# EAGLE design kegboard-mini (EAGLE 6.5.0)
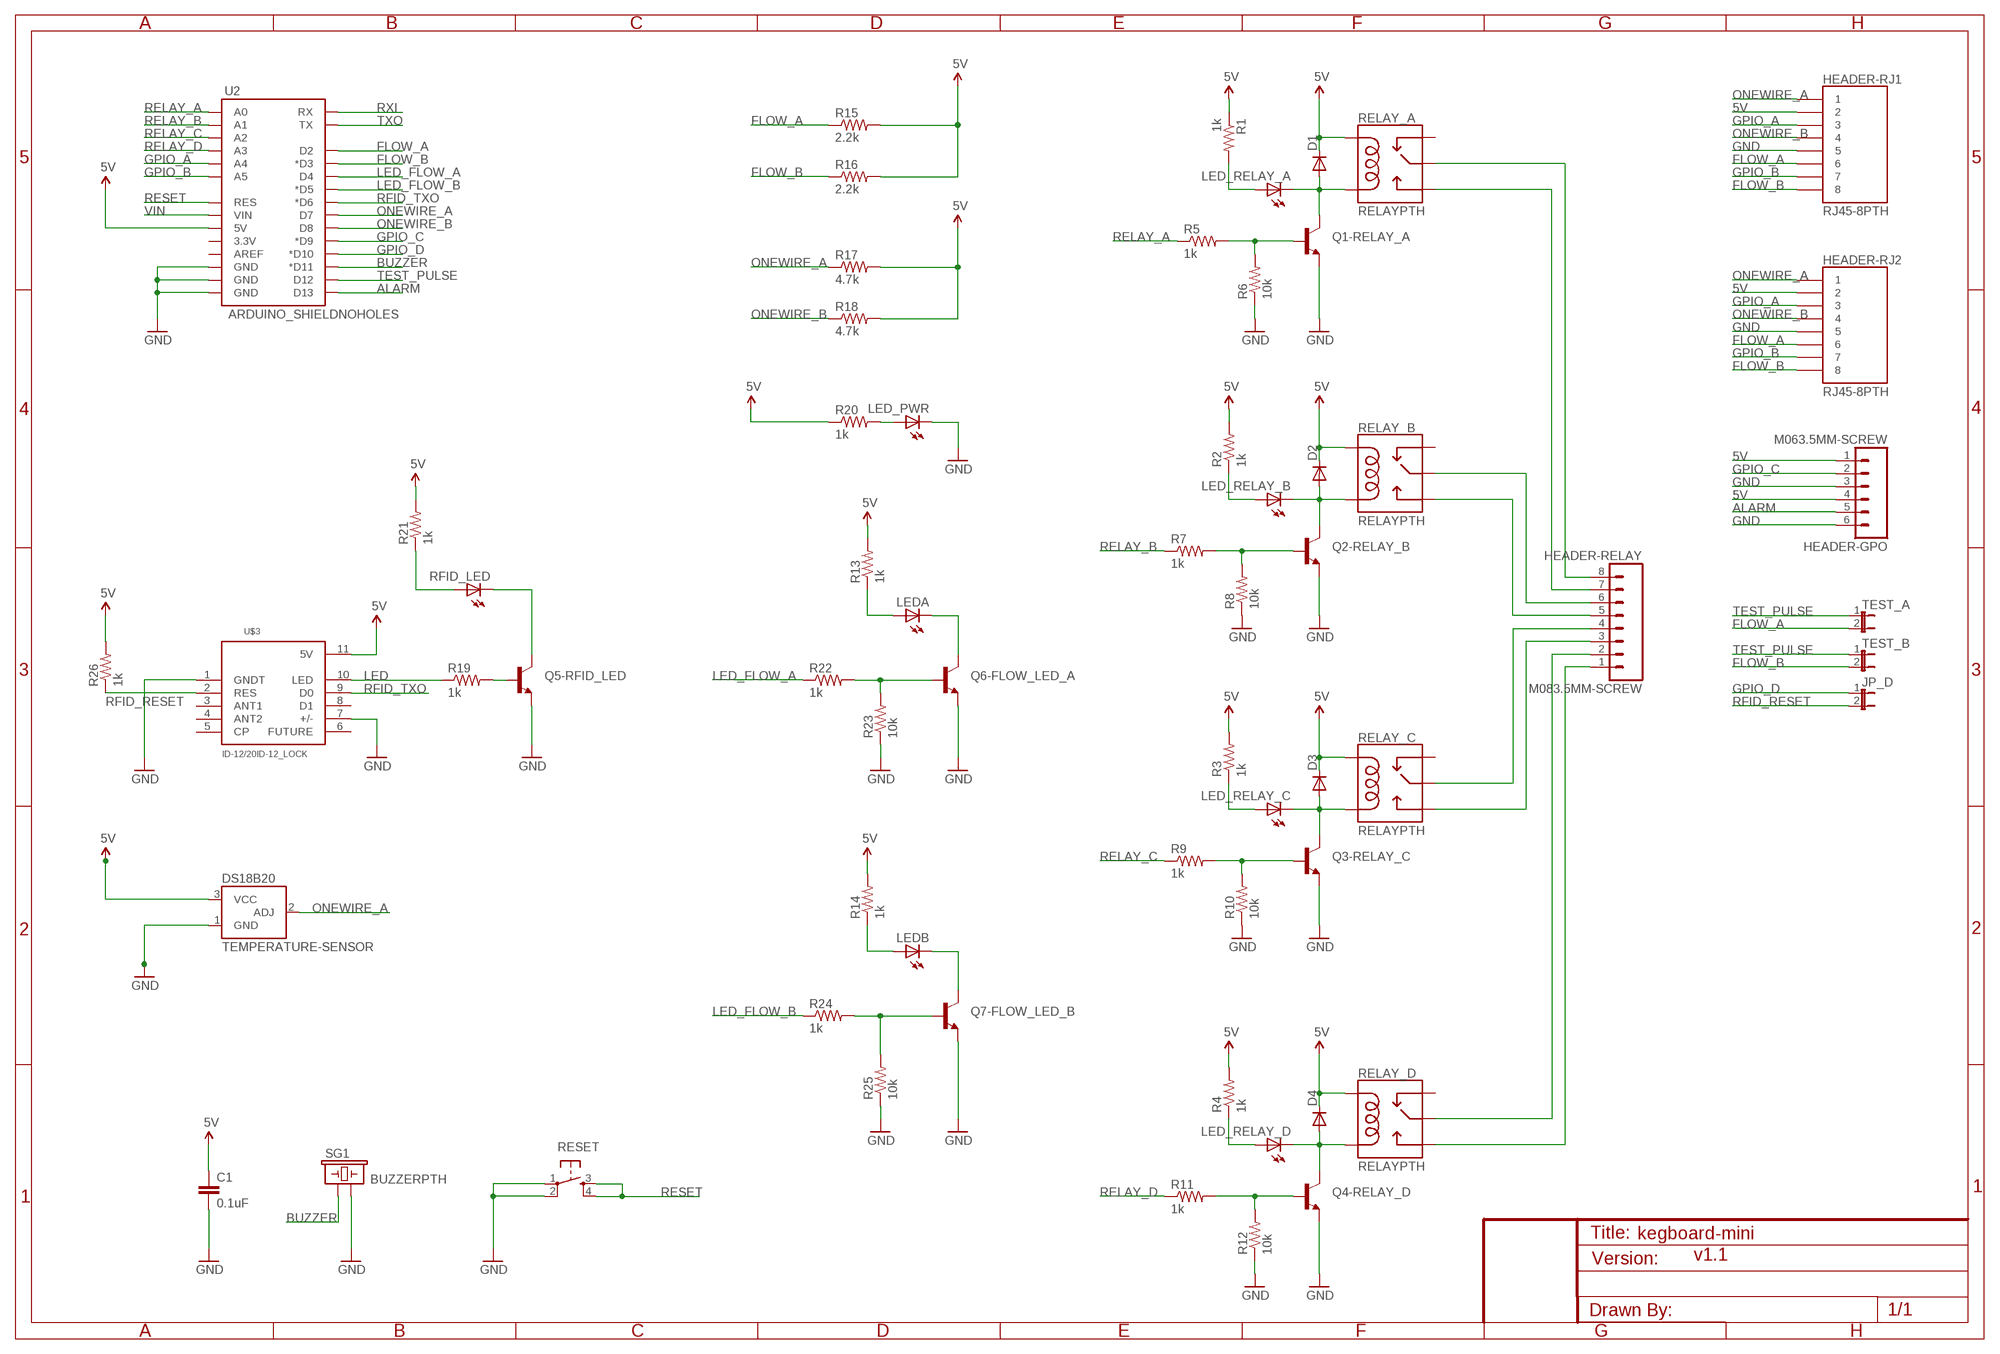
[diagram p0: schematic, sheet 1]

## Parts
C1  0.1uF  CAPPTH  [CAP-PTH-SMALL]
D1  DIODE1N4148  [DIODE-1N4148]
D2  DIODE1N4148  [DIODE-1N4148]
D3  DIODE1N4148  [DIODE-1N4148]
D4  DIODE1N4148  [DIODE-1N4148]
DS18B20  TEMPERATURE-SENSOR  [TO-92]
HEADER-GPO  M063.5MM-SCREW  M063.5MM-6  [SCREWTERMINAL-3.5MM-6]
HEADER-RELAY  M083.5MM-SCREW  M083.5MM-8  [SCREWTERMINAL-3.5MM-8]
HEADER-RJ1  RJ45-8PTH  [RJ45-8]
HEADER-RJ2  RJ45-8PTH  [RJ45-8]
JP_D  JUMPER-2PTH  [1X02]
LED_PWR  LED3MM  [LED3MM]
LED_RELAY_A  LED3MM  [LED3MM]
LED_RELAY_B  LED3MM  [LED3MM]
LED_RELAY_C  LED3MM  [LED3MM]
LED_RELAY_D  LED3MM  [LED3MM]
LEDA  LED3MM  [LED3MM]
LEDB  LED3MM  [LED3MM]
Q1-RELAY_A  TRANSISTOR_NPNTO92  [TO-92]
Q2-RELAY_B  TRANSISTOR_NPNTO92  [TO-92]
Q3-RELAY_C  TRANSISTOR_NPNTO92  [TO-92]
Q4-RELAY_D  TRANSISTOR_NPNTO92  [TO-92]
Q5-RFID_LED  TRANSISTOR_NPNTO92  [TO-92]
Q6-FLOW_LED_A  TRANSISTOR_NPNTO92  [TO-92]
Q7-FLOW_LED_B  TRANSISTOR_NPNTO92  [TO-92]
R1  1k  RESISTORPTH1  [AXIAL-0.3]
R2  1k  RESISTORPTH1  [AXIAL-0.3]
R3  1k  RESISTORPTH1  [AXIAL-0.3]
R4  1k  RESISTORPTH1  [AXIAL-0.3]
R5  1k  RESISTORPTH1  [AXIAL-0.3]
R6  10k  RESISTORPTH1  [AXIAL-0.3]
R7  1k  RESISTORPTH1  [AXIAL-0.3]
R8  10k  RESISTORPTH1  [AXIAL-0.3]
R9  1k  RESISTORPTH1  [AXIAL-0.3]
R10  10k  RESISTORPTH1  [AXIAL-0.3]
R11  1k  RESISTORPTH1  [AXIAL-0.3]
R12  10k  RESISTORPTH1  [AXIAL-0.3]
R13  1k  RESISTORPTH1  [AXIAL-0.3]
R14  1k  RESISTORPTH1  [AXIAL-0.3]
R15  2.2k  RESISTORPTH1  [AXIAL-0.3]
R16  2.2k  RESISTORPTH1  [AXIAL-0.3]
R17  4.7k  RESISTORPTH1  [AXIAL-0.3]
R18  4.7k  RESISTORPTH1  [AXIAL-0.3]
R19  1k  RESISTORPTH1  [AXIAL-0.3]
R20  1k  RESISTORPTH1  [AXIAL-0.3]
R21  1k  RESISTORPTH1  [AXIAL-0.3]
R22  1k  RESISTORPTH1  [AXIAL-0.3]
R23  10k  RESISTORPTH1  [AXIAL-0.3]
R24  1k  RESISTORPTH1  [AXIAL-0.3]
R25  10k  RESISTORPTH1  [AXIAL-0.3]
R26  1k  RESISTORPTH1  [AXIAL-0.3]
RELAY_A  RELAYPTH  [RELAY-G5Q]
RELAY_B  RELAYPTH  [RELAY-G5Q]
RELAY_C  RELAYPTH  [RELAY-G5Q]
RELAY_D  RELAYPTH  [RELAY-G5Q]
RESET  TAC_SWITCHPTH  [TACTILE-PTH]
RFID_LED  LED3MM  [LED3MM]
SG1  BUZZERPTH  [BUZZER-12MM]
TEST_A  JUMPER-2PTH  [1X02]
TEST_B  JUMPER-2PTH  [1X02]
U2  ARDUINO_SHIELDNOHOLES  [DUEMILANOVE_SHIELD_NOHOLES]
U$3  ID-12/20ID-12_LOCK  [ID-12_LOCK]

## Nets
5V: C1.1 D1.C D2.C D3.C D4.C DS18B20.3(VCC) HEADER-GPO.1 HEADER-GPO.4 HEADER-RJ1.2 HEADER-RJ2.2 R1.P$1 R2.P$2 R3.P$2 R4.P$2 R13.P$2 R14.P$2 R15.P$2 R16.P$2 R17.P$2 R18.P$2 R20.P$1 R21.P$2 R26.P$2 RELAY_A.5(COIL1) RELAY_B.5(COIL1) RELAY_C.5(COIL1) RELAY_D.5(COIL1) U2.5V U$3.11(5V)
ALARM: HEADER-GPO.5 U2.D13
BUZZER: SG1.+ U2.D11(*D11)
FLOW_A: HEADER-RJ1.6 HEADER-RJ2.6 R15.P$1 TEST_A.2 U2.D2
FLOW_B: HEADER-RJ1.8 HEADER-RJ2.8 R16.P$1 TEST_B.2 U2.D3(*D3)
GND: C1.2 DS18B20.1(GND) HEADER-GPO.3 HEADER-GPO.6 HEADER-RJ1.5 HEADER-RJ2.5 LED_PWR.K(C) Q1-RELAY_A.1(E) Q2-RELAY_B.1(E) Q3-RELAY_C.1(E) Q4-RELAY_D.1(E) Q5-RFID_LED.1(E) Q6-FLOW_LED_A.1(E) Q7-FLOW_LED_B.1(E) R6.P$1 R8.P$1 R10.P$1 R12.P$1 R23.P$1 R25.P$1 RESET.1 RESET.2 SG1.- U2.GND@0(GND) U2.GND@1(GND) U2.GND@2(GND) U$3.1(GNDT) U$3.7(+/-)
GPIO_A: HEADER-RJ1.3 HEADER-RJ2.3 U2.A4
GPIO_B: HEADER-RJ1.7 HEADER-RJ2.7 U2.A5
GPIO_C: HEADER-GPO.2 U2.D9(*D9)
GPIO_D: JP_D.1 U2.D10(*D10)
LED: R19.P$1 U$3.10(LED)
LED_FLOW_A: R22.P$1 U2.D4
LED_FLOW_B: R24.P$1 U2.D5(*D5)
N$1: LED_RELAY_A.A R1.P$2
N$2: Q2-RELAY_B.2(B) R7.P$2 R8.P$2
N$3: Q1-RELAY_A.2(B) R5.P$2 R6.P$2
N$4: Q3-RELAY_C.2(B) R9.P$2 R10.P$2
N$5: LED_RELAY_C.A R3.P$1
N$6: Q4-RELAY_D.2(B) R11.P$2 R12.P$2
N$7: LED_RELAY_B.A R2.P$1
N$8: LEDB.K(C) Q7-FLOW_LED_B.3(C)
N$9: LEDA.K(C) Q6-FLOW_LED_A.3(C)
N$10: D1.A LED_RELAY_A.K(C) Q1-RELAY_A.3(C) RELAY_A.1(COIL2)
N$11: LED_RELAY_D.A R4.P$1
N$12: D2.A LED_RELAY_B.K(C) Q2-RELAY_B.3(C) RELAY_B.1(COIL2)
N$13: LED_PWR.A R20.P$2
N$14: D3.A LED_RELAY_C.K(C) Q3-RELAY_C.3(C) RELAY_C.1(COIL2)
N$15: HEADER-RELAY.8 RELAY_A.2(MAIN)
N$16: D4.A LED_RELAY_D.K(C) Q4-RELAY_D.3(C) RELAY_D.1(COIL2)
N$17: Q5-RFID_LED.2(B) R19.P$2
N$18: R21.P$1 RFID_LED.A
N$19: Q5-RFID_LED.3(C) RFID_LED.K(C)
N$20: HEADER-RELAY.7 RELAY_A.3(NO)
N$21: HEADER-RELAY.6 RELAY_B.2(MAIN)
N$22: HEADER-RELAY.5 RELAY_B.3(NO)
N$23: HEADER-RELAY.4 RELAY_C.2(MAIN)
N$24: LEDA.A R13.P$1
N$25: HEADER-RELAY.3 RELAY_C.3(NO)
N$26: HEADER-RELAY.2 RELAY_D.2(MAIN)
N$27: HEADER-RELAY.1 RELAY_D.3(NO)
N$28: LEDB.A R14.P$1
N$30: Q6-FLOW_LED_A.2(B) R22.P$2 R23.P$2
N$31: Q7-FLOW_LED_B.2(B) R24.P$2 R25.P$2
ONEWIRE_A: DS18B20.2(ADJ) HEADER-RJ1.1 HEADER-RJ2.1 R17.P$1 U2.D7
ONEWIRE_B: HEADER-RJ1.4 HEADER-RJ2.4 R18.P$1 U2.D8
RELAY_A: R5.P$1 U2.A0
RELAY_B: R7.P$1 U2.A1
RELAY_C: R9.P$1 U2.A2
RELAY_D: R11.P$1 U2.A3
RESET: RESET.3 RESET.4 U2.RES
RFID_RESET: JP_D.2 R26.P$1 U$3.2(RES)
RFID_TXO: U2.D6(*D6) U$3.9(D0)
RXI: U2.RX
TEST_PULSE: TEST_A.1 TEST_B.1 U2.D12
TXO: U2.TX
VIN: U2.VIN
Unconnected: RELAY_A.4(NC) RELAY_B.4(NC) RELAY_C.4(NC) RELAY_D.4(NC) U2.3.3V U2.AREF U$3.3(ANT1) U$3.4(ANT2) U$3.5(CP) U$3.6(FUTURE) U$3.8(D1)

## Notes on the sheet
- v1.1

## Library data of the parts
C1 = SparkFun:CAP: Capacitor Standard 0603 ceramic capacitor, and 0.1" leaded capacitor.
D1-D4 = SparkFun:DIODE: Diode These are standard reverse protection diodes and small signal diodes. SMA package can handle up to about 1A. SOD-323 can handle about 200mA. What the SOD-323 package when ordering, there are some mfgs out there that are 5-pin packages.
DS18B20 = geoffculp:TEMPERATURE-SENSOR
HEADER-GPO = SparkFun:M06: Header 6 Standard 6-pin 0.1" header. Use with straight break away headers (SKU : PRT-00116), right angle break away headers (PRT-00553), swiss pins (PRT-00743), machine pins (PRT-00117), and female headers (PRT-00115). Molex polarized connector foot print use with SKU : PRT-08094 with associated crimp pins and housings. NOTES ON THE VARIANTS LOCK and LOCK_LONGPADS... This footprint was designed to help hold the alignment of a through-hole component (i.e. 6-pin header) while soldering it into place. You may notice that each hole has been shifted either up or down by 0.005 of an inch from it's more standard position (which is a perfectly straight line). This slight alteration caused the pins (the squares in the middle) to touch the edges of the holes. Because they are alternating, it causes a "brace" to hold the component in place. 0.005 has proven to be the perfect amount of "off-center" position when using our standard breakaway headers. Although looks a little odd when you look at the bare footprint, once you have a header in there, the alteration is very hard to notice. Also, if you push a header all the way into place, it is covered up entirely on the bottom side. This idea of altering the position of holes to aid alignment will be further integrated into the Sparkfun Library for other footprints. It can help hold any component with 3 or more connection pins.
HEADER-RELAY = SparkFun:M08: Header 8 Standard 8-pin 0.1" header. Use with straight break away headers (SKU : PRT-00116), right angle break away headers (PRT-00553), swiss pins (PRT-00743), machine pins (PRT-00117), and female headers (PRT-00115).
HEADER-RJ1 HEADER-RJ2 = SparkFun:RJ45-8: RJ45 Jack Simple RJ45, 8-pin connection - connector for common Cat5, Cat5e, and Cat6 Ethernet cables. Footprint not yet proven in production. Connector sku is PRT-00643; Breakout PCB sku is BOB-00716.
JP_D TEST_A TEST_B = SparkFun-20100412:JUMPER-2: Jumper Basic 0.1" spaced jumper. Use with breakaway headers.
LED_PWR LED_RELAY_A LED_RELAY_B LED_RELAY_C LED_RELAY_D LEDA LEDB RFID_LED = SparkFun:LED: LEDs Standard schematic elements and footprints for 5mm, 3mm, 1206, and 0603 sized LEDs. 5mm - Spark Fun Electronics SKU : COM-00529 (and others)
Q1-RELAY_A Q2-RELAY_B Q3-RELAY_C Q4-RELAY_D Q5-RFID_LED Q6-FLOW_LED_A Q7-FLOW_LED_B = SparkFun:TRANSISTOR_NPN: Transistor NPN BJT configuration in SOT23 package. MMBT2222 is the common NPN we use. Double check BCE configuration again layout.
R1-R26 = SparkFun:RESISTOR: Resistor Basic schematic elements and footprints for 0603, 1206, and PTH 1/10th watt (small) resistors.
RELAY_A RELAY_B RELAY_C RELAY_D = SparkFun:RELAY
RESET = SparkFun:TAC_SWITCH: Momentary Switch Button commonly used for reset or general input. Spark Fun Electronics SKU : COM-00097
SG1 = SparkFun:BUZZER: Buzzer 12mm Spark Fun Electronics SKU : Comp-Buzzer
U2 = SparkFun:ARDUINO_SHIELD
U$3 = SparkFun-20100412:ID-12/20: ID2, ID12, and ID20 Package

## Board
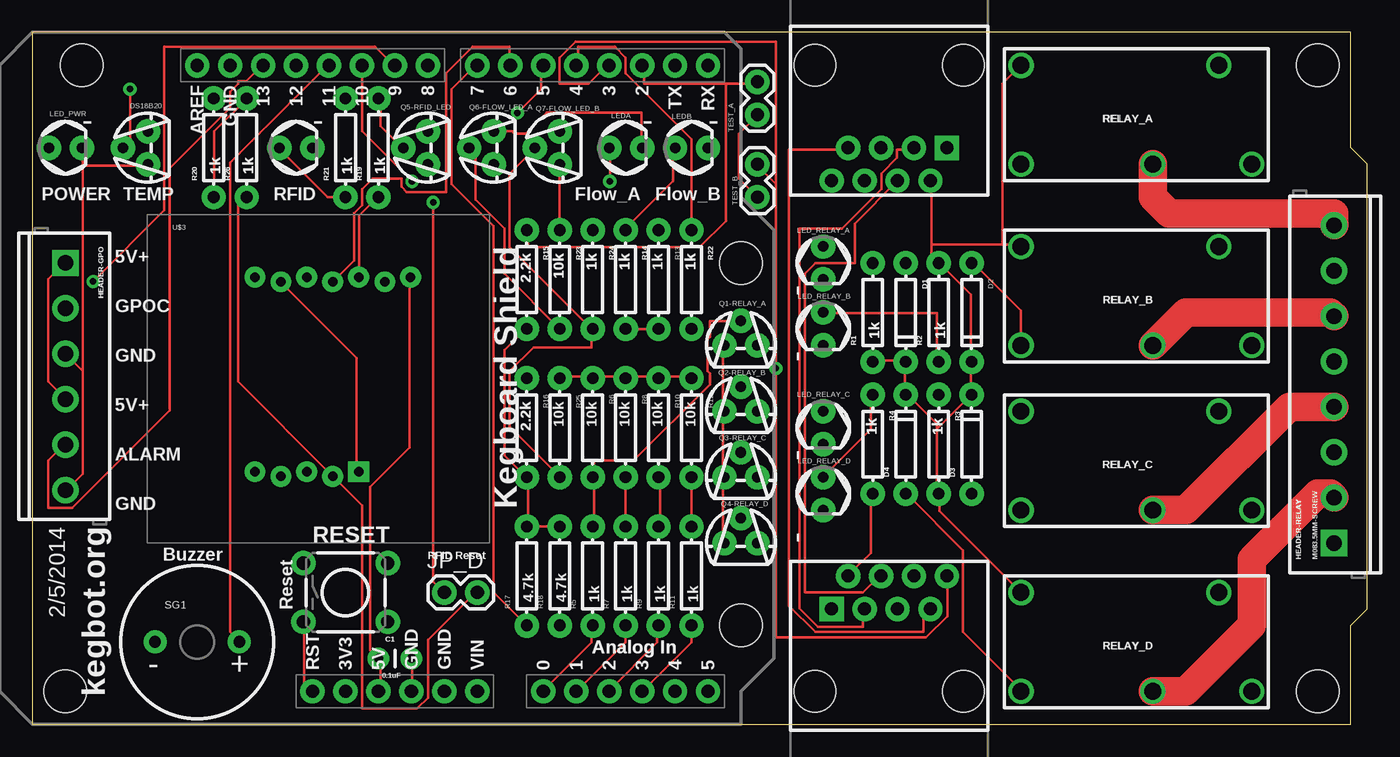
[diagram p1: board, top side]
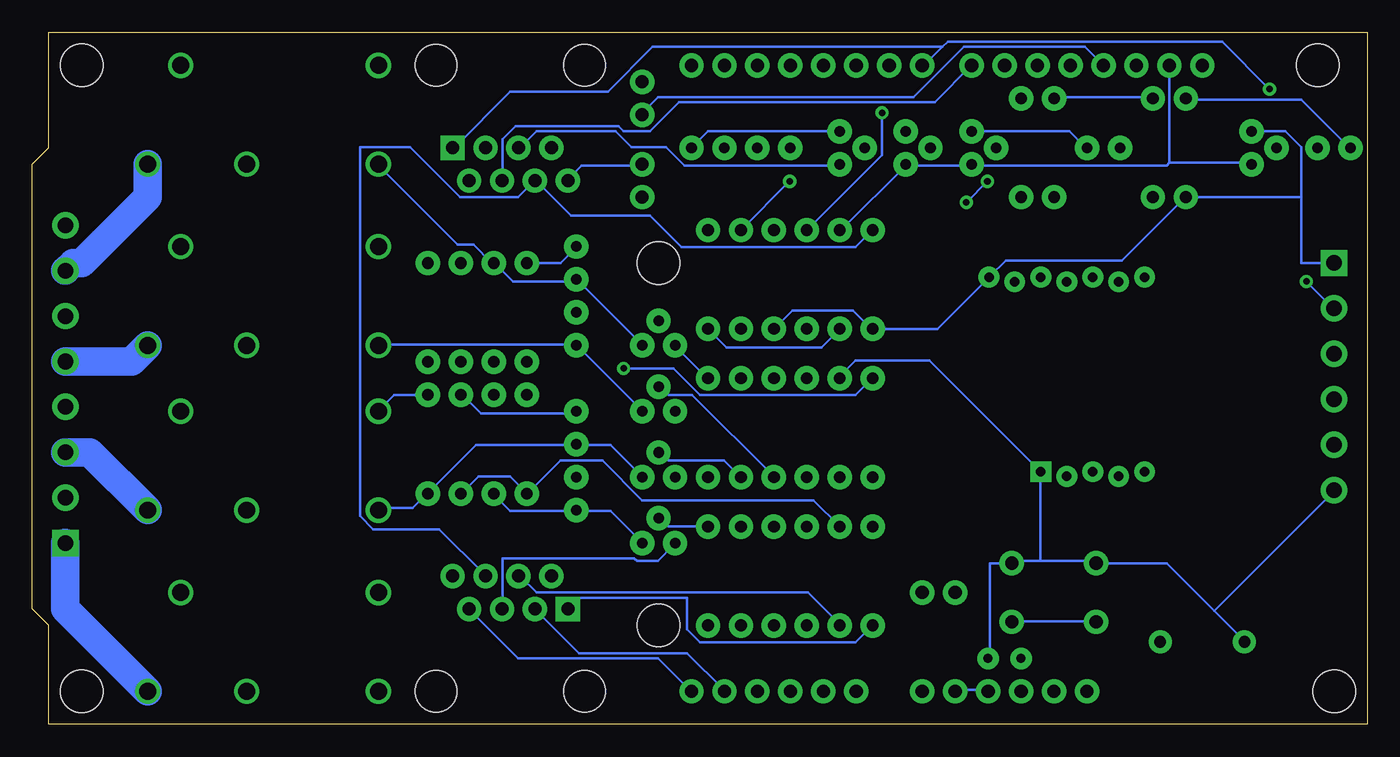
[diagram p2: board, bottom side, seen from below]

Size 102.87 x 53.34 mm. Coordinates in mm from the lower left corner, seen from the top.
Outline: 0,53.34 0,0 101.6,0 101.6,7.62 102.87,8.89 102.87,43.18 101.6,44.45 101.6,53.34 0,53.34
Copper layers (1*16): Top 0.035mm / dielectric 1.5mm / Bottom 0.035mm
Design rules "SparkFun": minimum track width 8mil, minimum drill 20mil, track to track 8mil, track to pad 8mil, pad to pad 8mil, via to via 8mil, smd to smd 8mil, copper to edge 10mil, drill to drill 8mil, minimum pad ring 12mil, minimum via ring 10mil, stop-mask expansion 4mil, vias tented up to drill 25mil, thermal gap 10mil

### Footprints (pad centres in the part's own frame; a part is rotated, then mirrored left to right if it is on the bottom)
CAP-PTH-SMALL = drill 0.7 pad 1.651: 1 0,0; 2 2.54,0
DIODE-1N4148 = drill 0.9 pad 1.88: A -3.81,0; C 3.81,0
TO-92 = drill 0.813 pad 1.88: 1 -1.27,0; 2 0,1.905; 3 1.27,0
SCREWTERMINAL-3.5MM-6 = drill 1.2 pad 2.032 square: 1 0,0 | drill 1.2 pad 2.032: 2 3.5,0; 3 7,0; 4 10.5,0; 5 14,0; 6 17.5,0
SCREWTERMINAL-3.5MM-8 = drill 1.2 pad 2.032 square: 1 0,0 | drill 1.2 pad 2.032: 2 3.5,0; 3 7,0; 4 10.5,0; 5 14,0; 6 17.5,0; 7 21,0; 8 24.5,0
RJ45-8 = drill 1 pad 1.88 square: 1 -4.445,6.35 | drill 1 pad 1.88: 2 -3.175,8.89; 3 -1.905,6.35; 4 -0.635,8.89; 5 0.635,6.35; 6 1.905,8.89; 7 3.175,6.35; 8 4.445,8.89 | hole 3.2: -5.715,0; 5.715,0
STAND-OFF = hole 3.302: 0,0
1X02 = drill 1.016 pad 1.88: 1 0,0; 2 2.54,0
LED3MM = drill 0.813 pad 1.88: A -1.27,0; K 1.27,0
AXIAL-0.3 = drill 0.9 pad 1.88: P$1 -3.81,0; P$2 3.81,0
RELAY-G5Q = drill 1.3: 1 8.89,3.81; 2 -1.27,3.81; 3 -8.89,3.81; 4 -6.35,-3.81; 5 8.89,-3.81
TACTILE-PTH = drill 1.016 pad 1.88: 1 -3.251,2.261; 2 3.251,2.261; 3 -3.251,-2.261; 4 3.251,-2.261
BUZZER-12MM = drill 0.9 pad 1.778: + 3.25,0; - -3.25,0
DUEMILANOVE_SHIELD_NOHOLES = drill 1.016 pad 1.88: 3.3V 50.8,26.67; 5V 50.8,29.21; A0 50.8,41.91; A1 50.8,44.45; A2 50.8,46.99; A3 50.8,49.53; A4 50.8,52.07; A5 50.8,54.61; AREF 2.54,15.24; D2 2.54,49.53; D3 2.54,46.99; D4 2.54,44.45; D5 2.54,41.91; D6 2.54,39.37; D7 2.54,36.83; D8 2.54,33.02; D9 2.54,30.48; D10 2.54,27.94; D11 2.54,25.4; D12 2.54,22.86; D13 2.54,20.32; GND@0 50.8,31.75; GND@1 50.8,34.29; GND@2 2.54,17.78; RES 50.8,24.13; RX 2.54,54.61; TX 2.54,52.07; VIN 50.8,36.83
ID-12_LOCK = drill 0.737 pad 1.6 square: 1 16.255,5.498 | drill 0.737 pad 1.6: 2 14.255,5.142; 3 12.255,5.498; 4 10.255,5.142; 5 8.255,5.498; 6 8.255,20.498; 7 10.255,20.142; 8 12.255,20.498; 9 14.255,20.142; 10 16.255,20.498; 11 20.255,20.498; NC 18.268,20.142

### Placement (x,y rotation side)
C1  26.67,5.08 0 top
D1  67.31,31.75 270 top
D2  72.39,31.75 270 top
D3  72.39,21.59 90 top
D4  67.31,21.59 90 top
DS18B20  8.89,44.45 90 top
HEADER-GPO  2.54,35.56 270 top
HEADER-RELAY  100.33,13.97 90 top
HEADER-RJ1  66.04,50.8 180 top
HEADER-RJ2  66.04,2.54 0 top
JP1  STAND-OFF  [STAND-OFF]  3.81,50.8 270 top
JP2  STAND-OFF  [STAND-OFF]  2.54,2.54 270 top
JP3  STAND-OFF  [STAND-OFF]  99.06,50.8 270 top
JP4  STAND-OFF  [STAND-OFF]  99.06,2.54 270 top
JP5  STAND-OFF  [STAND-OFF]  54.61,7.62 270 top
JP6  STAND-OFF  [STAND-OFF]  54.61,35.56 270 top
JP_D  31.75,10.16 0 top
LED_PWR  2.54,44.45 0 top
LED_RELAY_A  60.96,35.56 270 top
LED_RELAY_B  60.96,30.48 270 top
LED_RELAY_C  60.96,22.86 270 top
LED_RELAY_D  60.96,17.78 270 top
LEDA  45.72,44.45 0 top
LEDB  50.8,44.45 0 top
Q1-RELAY_A  54.61,29.21 0 top
Q2-RELAY_B  54.61,24.13 0 top
Q3-RELAY_C  54.61,19.05 0 top
Q4-RELAY_D  54.61,13.97 0 top
Q5-RFID_LED  30.48,44.45 90 top
Q6-FLOW_LED_A  35.56,44.45 90 top
Q7-FLOW_LED_B  40.64,44.45 90 top
R1  64.77,31.75 90 top
R2  69.85,31.75 90 top
R3  69.85,21.59 270 top
R4  64.77,21.59 270 top
R5  43.18,11.43 90 top
R6  43.18,22.86 270 top
R7  45.72,11.43 90 top
R8  45.72,22.86 270 top
R9  48.26,11.43 90 top
R10  48.26,22.86 270 top
R11  50.8,11.43 90 top
R12  50.8,22.86 270 top
R13  48.26,34.29 270 top
R14  45.72,34.29 270 top
R15  38.1,34.29 270 top
R16  38.1,22.86 270 top
R17  38.1,11.43 90 top
R18  40.64,11.43 90 top
R19  26.67,44.45 90 top
R20  13.97,44.45 90 top
R21  24.13,44.45 90 top
R22  50.8,34.29 270 top
R23  40.64,34.29 270 top
R24  43.18,34.29 270 top
R25  40.64,22.86 270 top
R26  16.51,44.45 90 top
RELAY_A  85.09,46.99 180 top
RELAY_B  85.09,33.02 180 top
RELAY_C  85.09,20.32 180 top
RELAY_D  85.09,6.35 180 top
RESET  24.13,10.16 0 top
RFID_LED  20.32,44.45 0 top
SG1  12.7,6.35 0 top
TEST_A  55.88,46.99 90 top
TEST_B  55.88,40.64 90 top
U2  -2.54,53.34 270 top
U$3  8.89,13.97 0 top

### Tracks (layer width: path | path; a pad name or v marks a point on that pad's centre or on a via)
5V
  Top 0.203: 69.29,36.98 69.29,41.86 HEADER-RJ1.2 | 69.29,36.98 69.29,35.97 69.7,35.56 R2.P$2 69.9,35.56 72.34,33.12 72.34,28.04 D2.C 72.34,27.84 72.34,25.4 | 69.29,36.98 74.78,36.98 | 74.78,36.98 76.2,36.98 RELAY_B.5 | RELAY_A.5 74.78,49.38 74.78,36.98 | R1.P$1 64.82,28.04 67.26,28.04 D1.C 67.26,27.84 67.26,25.4 D4.C 67.46,25.4 69.7,23.16 69.7,22.76 | HEADER-RJ2.2 62.99,11.58 64.62,13.21 64.62,17.68 R4.P$2 | RELAY_D.5 69.9,16.46 69.9,17.68 R3.P$2 69.7,17.88 69.7,22.76 | 69.7,22.76 72.34,25.4 | 72.34,25.4 D3.C | HEADER-GPO.4 2.44,25.2 1.22,26.42 1.22,34.34 2.44,35.56 HEADER-GPO.1 | R26.P$2 16.46,48.16 14.02,45.72 14.02,40.64 R20.P$1 | 38.2,15.24 R18.P$2 | 38.2,15.24 38.2,18.9 R16.P$2 38,19.1 36.37,20.73 36.37,28.85 38,30.48 R15.P$2 | 38.2,15.24 R17.P$2 | R14.P$2 R13.P$2 | U2.5V 26.82,2.64 26.82,5.08 C1.1 26.62,5.08 26.01,5.69 26.01,18.29 29.06,21.34 29.06,34.34 U$3.11
  Bottom 0.203: RELAY_C.5 76.2,24.18 74.98,25.4 D3.C | R3.P$2 69.7,17.88 68.48,19.1 66.04,19.1 64.82,17.88 R4.P$2 64.62,17.88 62.18,20.32 58.93,20.32 55.88,17.27 42.67,17.27 R18.P$2 | R26.P$2 16.66,48.36 23.98,48.36 R21.P$2 | 5.08,40.64 5.08,35.56 HEADER-GPO.1 | 5.08,40.64 5.08,44.5 6.3,45.72 DS18B20.3 | 5.08,40.64 R20.P$1 14.02,40.64 18.9,35.76 27.84,35.76 29.06,34.54 U$3.11 29.26,34.34 33.12,30.48 R15.P$2 38.2,30.48 39.62,31.9 44.3,31.9 R14.P$2
ALARM
  Top 0.203: U2.D13 17.68,50.8 16.46,49.58 15.85,49.58 15.85,49.38 15.24,48.77 15.24,47.55 10.57,42.88 10.57,24.18 3.05,16.66 1.22,16.66 1.22,20.32 2.44,21.54 HEADER-GPO.5
BUZZER
  Top 0.203: SG1.+ 15.85,6.5 15.24,7.11 15.24,43.28 22.76,50.8 U2.D11
FLOW_A
  Top 0.203: 53.44,49.38 47.14,49.38 47.14,50.8 U2.D2 | 53.44,49.38 55.88,49.38 TEST_A.2 | 53.44,49.38 53.44,38.81 51.41,36.78 38.2,36.78 38.2,38 R15.P$1
  Bottom 0.203: HEADER-RJ2.6 68.07,11.58 71.53,15.04 76.61,15.04 77.62,16.05 77.62,44.5 73.76,44.5 69.9,40.64 65.43,40.64 64.21,41.86 HEADER-RJ1.6 64.01,41.86 61.37,39.22 55.27,39.22 52.83,36.78 39.42,36.78 R15.P$1
FLOW_B  (via drill 0.51)
  Top 0.203: 57.3,41.66 v57.3,27.43 57.3,6.71 68.89,6.71 70.51,8.33 70.51,11.38 HEADER-RJ2.8 | 57.3,41.66 55.88,43.08 TEST_B.2 | 57.3,41.66 57.3,52.63 41.86,52.63 40.64,51.41 40.64,49.38 42.88,49.38 44.3,50.8 U2.D3
  Bottom 0.203: v57.3,27.43 53.44,27.43 51.41,25.4 39.42,25.4 38.2,26.62 R16.P$1 | HEADER-RJ1.8 61.57,42.06 60.55,43.08 55.88,43.08 TEST_B.2
GND
  Top 0.203: 3.86,43.08 8.74,43.08 DS18B20.1 | 3.86,43.08 3.86,44.3 LED_PWR.K | R23.P$1 Q7-FLOW_LED_B.1 | Q1-RELAY_A.1 53.24,29.06 53.24,24.18 Q2-RELAY_B.1 53.24,23.98 53.24,19.1 Q3-RELAY_C.1 53.24,18.9 53.24,14.02 Q4-RELAY_D.1 | R12.P$1 50.8,26.82 48.36,26.82 R10.P$1 48.16,26.82 45.72,26.82 | R25.P$1 40.64,26.82 43.08,26.82 R6.P$1 43.28,26.82 45.72,26.82 | 45.72,26.82 R8.P$1 | 3.86,27.23 2.64,28.45 HEADER-GPO.3 | 3.86,27.23 3.86,19.3 2.64,18.09 HEADER-GPO.6 | C1.2 29.26,5.08 29.26,2.64 U2.GND@0 | U$3.7 19.3,33.93 24.99,28.25 24.99,19.51 U$3.1 | 3.86,27.23 3.86,43.08
  Bottom 0.203: 15.24,43.28 U2.GND@2 | 15.24,43.28 8.94,43.28 DS18B20.1 | 30.48,43.08 35.56,43.08 | HEADER-RJ1.5 65.23,44.5 64.01,45.72 57.91,45.72 56.69,44.5 54.05,44.5 52.63,43.08 40.64,43.08 Q7-FLOW_LED_B.1 | 35.56,43.08 40.44,38.2 40.64,38.2 R23.P$1 | 35.56,43.08 Q6-FLOW_LED_A.1 | 15.24,43.28 15.44,43.08 30.48,43.08 | 30.48,43.08 Q5-RFID_LED.1 | Q1-RELAY_A.1 53.24,29.06 51,26.82 50.8,26.82 R12.P$1 | HEADER-RJ2.5 66.65,8.94 66.65,12.8 56.49,12.8 56.29,12.6 54.66,12.6 53.44,13.82 Q4-RELAY_D.1 | 11.79,8.74 15.44,12.39 20.73,12.39 RESET.1 20.93,12.6 25.2,12.6 | 11.79,8.74 9.55,6.5 SG1.- | 11.79,8.74 2.64,17.88 HEADER-GPO.6 | U2.GND@1 31.7,2.64 29.26,2.64 U2.GND@0 | 25.2,12.6 25.2,19.3 U$3.1 25.2,19.51 33.73,28.04 39.42,28.04 40.64,26.82 R25.P$1 | 25.2,12.6 27.23,12.6 RESET.2 27.43,12.39 29.06,12.39 29.06,5.08 C1.2
GPIO_A
  Top 0.203: HEADER-RJ1.3 67.87,44.3 66.65,44.3 66.65,43.69 65.43,42.47 65.43,41.25 62.38,38.2 59.13,38.2 59.13,8.94 60.55,7.52 64.01,7.52 64.01,8.74 HEADER-RJ2.3
  Bottom 0.203: U2.A4 49.58,2.64 52.43,5.49 60.76,5.49 64.01,8.74 HEADER-RJ2.3
GPIO_B
  Top 0.203: HEADER-RJ1.7 62.79,44.3 58.32,44.3 58.32,9.14 60.35,7.11 68.68,7.11 68.68,8.33 69.09,8.74 HEADER-RJ2.7
  Bottom 0.203: U2.A5 52.22,2.64 54.66,5.08 65.43,5.08 69.09,8.74 HEADER-RJ2.7
GPIO_C  (via drill 0.51)
  Top 0.203: v4.67,34.14 10.16,39.62 10.16,52.22 26.42,52.22 27.84,50.8 U2.D9
  Bottom 0.203: v4.67,34.14 2.64,32.11 HEADER-GPO.2
GPIO_D  (via drill 0.51)
  Top 0.203: v30.89,40.23 30.89,10.97 31.7,10.16 JP_D.1 | v29.26,41.86 25.4,45.72 U2.D10
  Bottom 0.203: v30.89,40.23 v29.26,41.86
LED
  Top 0.203: U$3.10 25.2,34.54 25.2,39.22 26.62,40.64 R19.P$1
LED_FLOW_A
  Top 0.203: R22.P$1 50.8,45.11 45.72,50.19 45.72,51.41 44.91,52.22 42.06,52.22 42.06,50.8 U2.D4
LED_FLOW_B  (via drill 0.51)
  Top 0.203: v37.39,47.14 39.22,48.97 39.22,50.8 U2.D5
  Bottom 0.203: v37.39,47.14 37.39,43.89 R24.P$1
N$1
  Bottom 0.203: LED_RELAY_A.A 60.96,36.78 62.18,35.56 R1.P$2
N$2
  Top 0.203: R7.P$2 R8.P$2
  Bottom 0.203: Q2-RELAY_B.2 54.46,26.01 53.85,25.4 52.02,25.4 45.72,19.1 R8.P$2
N$3
  Top 0.203: R5.P$2 43.28,15.24 43.28,18.9 R6.P$2 43.28,19.1 43.28,20.32 46.33,20.32 52.22,26.21 52.22,27.03 52.02,27.23 52.02,29.67 52.22,29.87 52.22,31.09 54.46,31.09 Q1-RELAY_A.2
N$4
  Top 0.203: R9.P$2 48.36,15.24 48.36,18.9 R10.P$2
  Bottom 0.203: Q3-RELAY_C.2 54.46,20.93 53.85,20.32 49.58,20.32 48.36,19.1 R10.P$2
N$5
  Bottom 0.203: LED_RELAY_C.A 60.96,23.98 68.28,23.98 69.7,25.4 R3.P$1
N$6
  Top 0.203: R11.P$2 R12.P$2
  Bottom 0.203: R11.P$2 53.85,15.24 54.46,15.85 Q4-RELAY_D.2
N$7
  Top 0.203: LED_RELAY_B.A 60.96,31.7 69.7,31.7 69.7,28.04 R2.P$1
N$8
  Bottom 0.203: Q7-FLOW_LED_B.3 50.8,45.72 LEDB.K
N$9
  Top 0.203: Q6-FLOW_LED_A.3 36.98,45.72 37.19,45.52 38,45.52 39.62,47.14 46.94,47.14 46.94,44.5 LEDA.K
N$10
  Bottom 0.203: 60.96,34.14 60.76,34.14 55.88,29.26 Q1-RELAY_A.3 | 60.96,34.14 65.84,34.14 67.26,35.56 D1.A 67.46,35.56 68.89,36.98 70.1,36.98 76.2,43.08 RELAY_A.1 | 60.96,34.14 LED_RELAY_A.K
N$11
  Top 0.203: LED_RELAY_D.A 60.96,19.1 64.62,22.76 64.62,25.4 R4.P$1
N$12
  Top 0.203: D2.A 72.54,35.56 76.2,31.9 RELAY_B.1
  Bottom 0.203: Q2-RELAY_B.3 55.88,24.18 60.76,29.06 60.96,29.06 LED_RELAY_B.K 60.96,29.26 76.2,29.26 RELAY_B.1
N$13
  Bottom 0.203: LED_PWR.A 1.42,44.5 5.08,48.16 13.82,48.16 R20.P$2
N$14
  Bottom 0.203: RELAY_C.1 76.2,16.66 73.56,16.66 72.54,17.68 D3.A 72.34,17.88 68.68,21.54 60.96,21.54 | 60.96,21.54 58.32,21.54 55.88,19.1 Q3-RELAY_C.3 | 60.96,21.54 LED_RELAY_C.K
N$15
  Top 2.184: RELAY_A.2 86.36,40.64 87.63,39.37 100.33,39.37 HEADER-RELAY.8
N$16
  Top 0.203: RELAY_D.1 76.2,2.64 71.73,7.11 71.73,13.41 67.46,17.68 D4.A
  Bottom 0.203: 60.96,16.46 58.32,16.46 55.88,14.02 Q4-RELAY_D.3 | 60.96,16.46 66.04,16.46 67.26,17.68 D4.A | 60.96,16.46 LED_RELAY_D.K
N$17
  Top 0.203: Q5-RFID_LED.2 28.45,44.5 26.82,46.13 26.82,48.16 R19.P$2
N$18
  Top 0.203: RFID_LED.A 19.1,44.3 22.76,40.64 R21.P$1
N$19
  Bottom 0.203: Q5-RFID_LED.3 22.96,45.72 21.74,44.5 RFID_LED.K
N$20
  Bottom 2.184: RELAY_A.3 93.98,40.64 99.06,35.56 99.74,35.56 HEADER-RELAY.7
N$21
  Top 2.184: RELAY_B.2 88.9,31.75 100.05,31.75 HEADER-RELAY.6
N$22
  Bottom 2.184: RELAY_B.3 95.22,27.97 HEADER-RELAY.5
N$23
  Top 2.184: HEADER-RELAY.4 96.86,24.47 88.9,16.51 RELAY_C.2
N$24  (via drill 0.51)
  Top 0.203: v44.5,41.86 44.5,44.3 LEDA.A
  Bottom 0.203: v44.5,41.86 R13.P$1
N$25
  Bottom 2.184: RELAY_C.3 98.44,20.97 HEADER-RELAY.3
N$26
  Top 2.184: HEADER-RELAY.2 100.02,17.78 99.06,17.78 93.98,12.7 93.98,7.62 88.9,2.54 RELAY_D.2
N$27
  Bottom 2.184: HEADER-RELAY.1 100.33,8.89 RELAY_D.3
N$28
  Top 0.203: R14.P$1 45.72,38.2 49.38,41.86 49.38,44.3 LEDB.A
N$30
  Top 0.203: R23.P$2 36.37,34.75 36.37,38.2 34.14,40.44 34.14,43.89 33.73,44.3 Q6-FLOW_LED_A.2
  Bottom 0.203: R23.P$2 42.06,29.06 49.38,29.06 R22.P$2
N$31
  Top 0.203: 43.08,30.48 43.08,29.06 38.61,29.06 36.78,27.23 36.78,22.96 40.64,19.1 R25.P$2 | 43.08,30.48 36.78,36.78 36.78,42.47 38.61,44.3 Q7-FLOW_LED_B.2 | 43.08,30.48 R24.P$2
ONEWIRE_A  (via drill 0.51)
  Top 0.203: v7.52,48.97 7.52,44.91 7.11,44.5 DS18B20.2 | R17.P$1 35.56,10.16 35.56,38.41 32.31,41.66 32.31,48.97 34.14,50.8 U2.D7
  Bottom 0.203: R17.P$1 39.42,6.3 51.41,6.3 52.43,7.32 52.43,9.75 60.76,9.75 61.57,8.94 HEADER-RJ2.1 | v7.52,48.97 11.18,52.63 32.31,52.63 32.72,52.22 | 32.72,52.22 34.14,50.8 U2.D7 | 32.72,52.22 55.07,52.22 58.52,48.77 66.04,48.77 70.31,44.5 HEADER-RJ1.1
ONEWIRE_B
  Top 0.203: HEADER-RJ2.4 65.23,11.38 64.01,10.16 59.54,10.16 59.54,34.75 60.35,35.56 63.4,35.56 63.4,38.61 66.65,41.86 HEADER-RJ1.4
  Bottom 0.203: R18.P$1 40.64,7.72 43.08,10.16 64.01,10.16 65.23,11.38 HEADER-RJ2.4 | U2.D8 33.33,47.95 53.03,47.95 55.27,45.72 57.3,45.72 57.71,46.13 65.63,46.13 66.65,45.11 66.65,42.06 HEADER-RJ1.4
RELAY_A
  Top 0.203: U2.A0 39.42,2.64 43.08,6.3 43.08,7.52 R5.P$1
RELAY_B
  Top 0.203: U2.A1 42.06,2.64 45.72,6.3 R7.P$1
RELAY_C
  Top 0.203: U2.A2 44.5,2.64 48.16,6.3 48.16,7.52 R9.P$1
RELAY_D
  Top 0.203: U2.A3 47.14,2.64 50.8,6.3 R11.P$1
RESET
  Top 0.203: U2.RES 21.54,2.64 20.93,3.25 20.93,7.72 RESET.3
  Bottom 0.203: RESET.4 27.23,7.92 20.93,7.92 RESET.3
RFID_RESET
  Top 0.203: R26.P$1 16.46,40.64 15.85,40.03 15.85,26.42 22.96,19.3 U$3.2 23.16,19.1 25.4,16.87 25.4,1.22 29.67,1.22 30.48,2.03 30.48,6.5 34.14,10.16 JP_D.2
RFID_TXO
  Top 0.203: U$3.9 23.16,34.14 24.79,35.76 24.79,39.42 25.4,40.03 25.4,41.25 26.21,42.06 28.45,42.06 28.45,41.45 28.85,41.05 31.9,41.05 31.9,50.19 33.93,52.22 36.78,52.22 36.78,50.8 U2.D6
TEST_PULSE
  Top 0.203: TEST_B.1 54.46,42.06 54.46,45.52 55.88,46.94 TEST_A.1
  Bottom 0.203: U2.D12 21.74,52.22 31.09,52.22 34.95,48.36 54.66,48.36 55.88,47.14 TEST_A.1

### Text on the board
tPlace: - | - | - | - | POWER | TEMP | RFID | Flow_A | Flow_B | Kegboard Shield | 5V+ | - | GPOC | GND | - | 5V+ | ALARM | - | GND | 2/5/2014 | kegbot.org | - | Buzzer | Reset | RFID Reset | - | +
tNames: RELAY_A | R20 | 1k | R26 | 1k | R21 | 1k | R19 | 1k | HEADER-GPO | R15 | R23 | R24 | R14 | R22 | 2.2k | 10k | 1k | 1k | 1k | D1 | RELAY_B | 1k | 1k | R1 | R2 | 2.2k | 1k | R4 | 1k | R3 | RELAY_C | D4 | D3 | RESET | HEADER-RELAY | M083.5MM-SCREW | C1 | Analog In | RELAY_D | 0.1uF